# Altium schematic sheet Power.SchDoc: =Name-1str
size 420 x 297 mm; SheetNumber: номер страницы; Вид изделия: Документация; Раздел: Документация; Код документа: Э3; Вид документа: Схема электрическая принципиальная; Класс документа: Конструкторский документ; Создавать изделие в PLM: Yes; DocumentCode: Э3; DocumentView: Схема электрическая принципиальная; DocumentClass: Конструкторский документ; ProductView: Документация
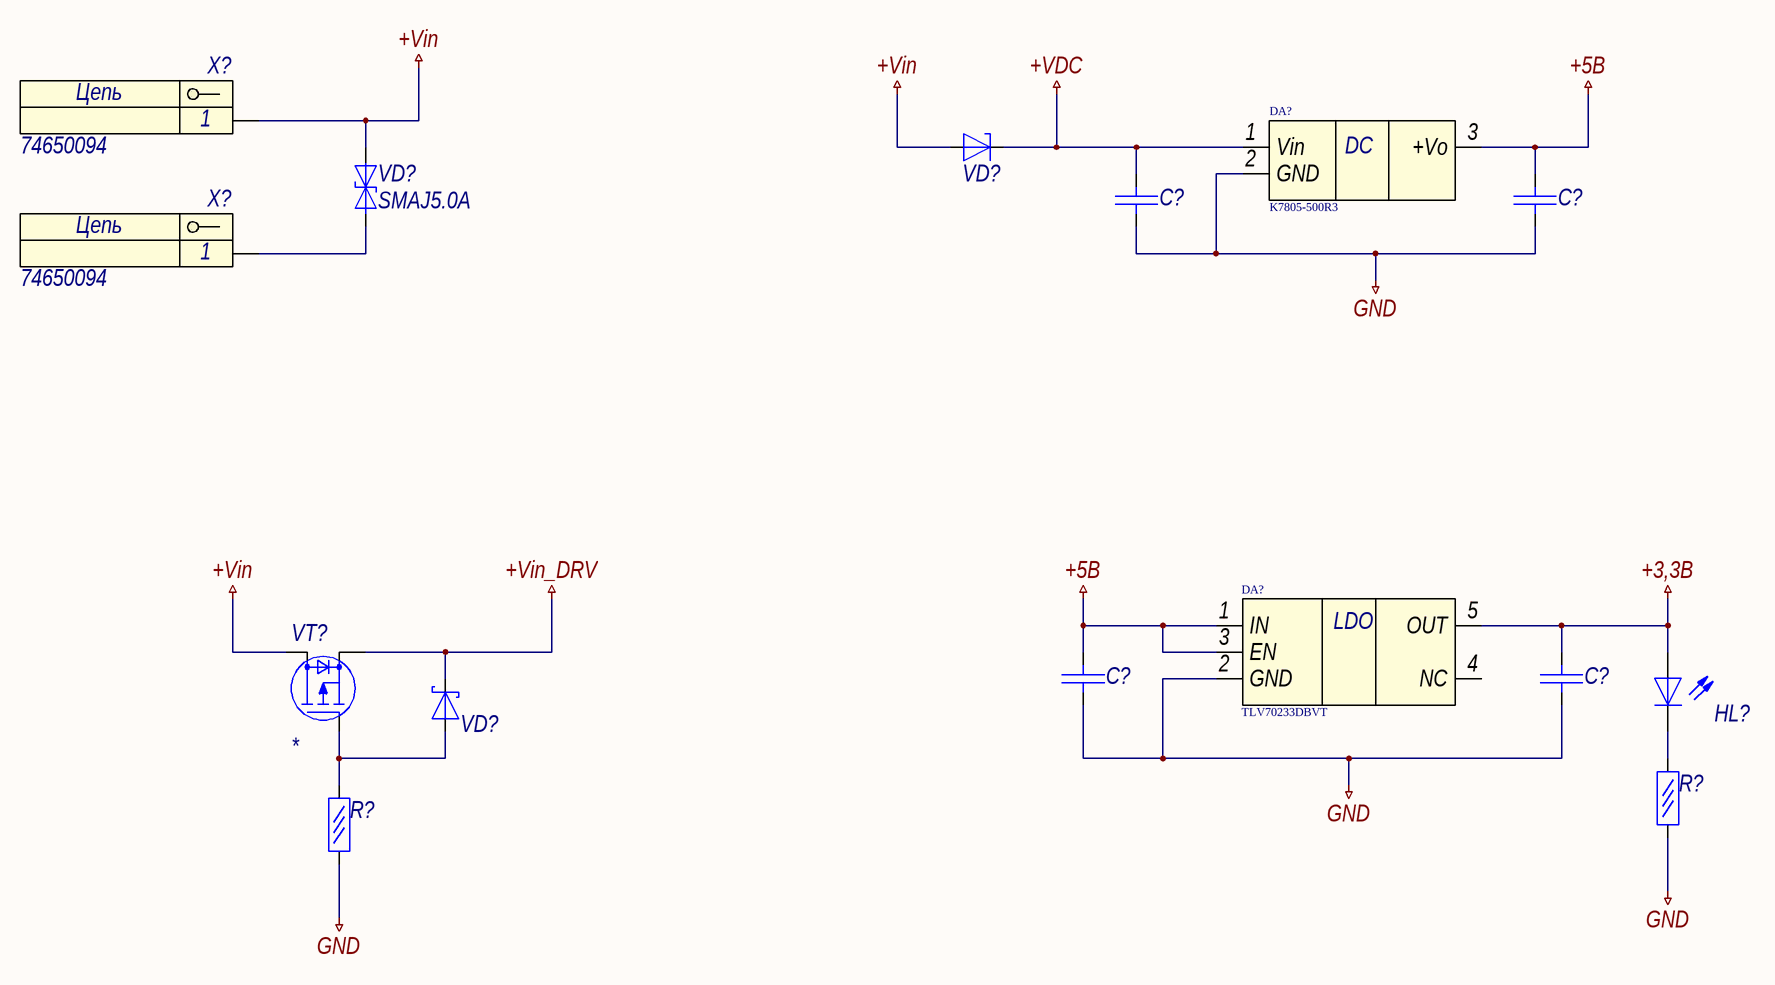
[diagram p0: Power.SchDoc]

## Parts
(Parts that share a designator on the sheet are numbered #1, #2 ... from top to bottom, then left to right.)
C?#1  (no value)  [C0805_AA]
C?#2  (no value)  [C0805_AA]
C?#3  (no value)  [C0805_AA]
C?#4  (no value)  [C0805_AA]
DA?#1  K7805-500R3
DA?#2  TLV70233DBVT
HL?  (no value)  [D0603_A]
R?#1  (no value)  [R1206]
R?#2  (no value)  [R1206]
VD?#1  (no value)  [SOT23-2_A]
VD?#2  SMAJ5.0A
VD?#3  (no value)  [SOD123_A]
VT?  *  [SOT23-3_A]
X?#1  74650094
X?#2  74650094

## Nets
+3,3В: C?#4.2 DA?#2.5(OUT) HL?.1(Анод)
+5В: C?#2.2 C?#3.2 DA?#1.3(+Vo) DA?#2.1(IN) DA?#2.3(EN)
+VDC: C?#1.2 DA?#1.1(Vin) VD?#1.1(K)
+Vin: VD?#1.2(A) VD?#2.2(K) VT?.3(D) X?#1.1
+Vin_DRV: VD?#3.1(K) VT?.2(S)
GND: C?#1.1 C?#2.1 C?#3.1 C?#4.1 DA?#1.2(GND) DA?#2.2(GND) R?#1.1 R?#2.1
NetHL?_2: HL?.2(Катод) R?#1.2
NetR?#2_2: R?#2.2 VD?#3.2(A) VT?.1(G)
NetVD?#2_1: VD?#2.1(A) X?#2.1

Not connected (* = marked no-connect by the designer): DA?#2 4(NC)

## Notes on the sheet
- Подп. и дата
- Инв. № дубл.
- Взам. инв. №
- Инв. № подл.
- Лист
- Изм.
- № докум.
- Подп.
- Дата
- Копировал
- Формат
- А3
- (in symbol K78xx-500R3) DC
- (in symbol TLV702) LDO
- (in symbol x1-k) Цепь

## Library data of the parts
C?#1-C?#4 = Конденсатор кер.
DA?#1 = K78xx-500R3: DC/DC преобразователь неизолированный
DA?#2 = TLV702: LDO Regulator
HL? = LED_R: Светодиод
R?#1 R?#2 = Резистор  0,05Вт: Резистор 0,05Вт; Power rating: 0,05Вт
VD?#1 = DiodeZener: Стабилитрон
VD?#2 = diode-2tvs: Ограничитель напряжения односторонний; Name: SMAJ5.0A
VD?#3 = DiodeSchottky: Диод Шоттки
VT? = P-MOSFET: Name: *; Vds: *; Vgs: *; Ids: *
X?#1 X?#2 = x1-k: Разъем - 1 конт. клемма; Name: 74650094